# Altium schematic sheet communication.SchDoc: Communication-interface
size B
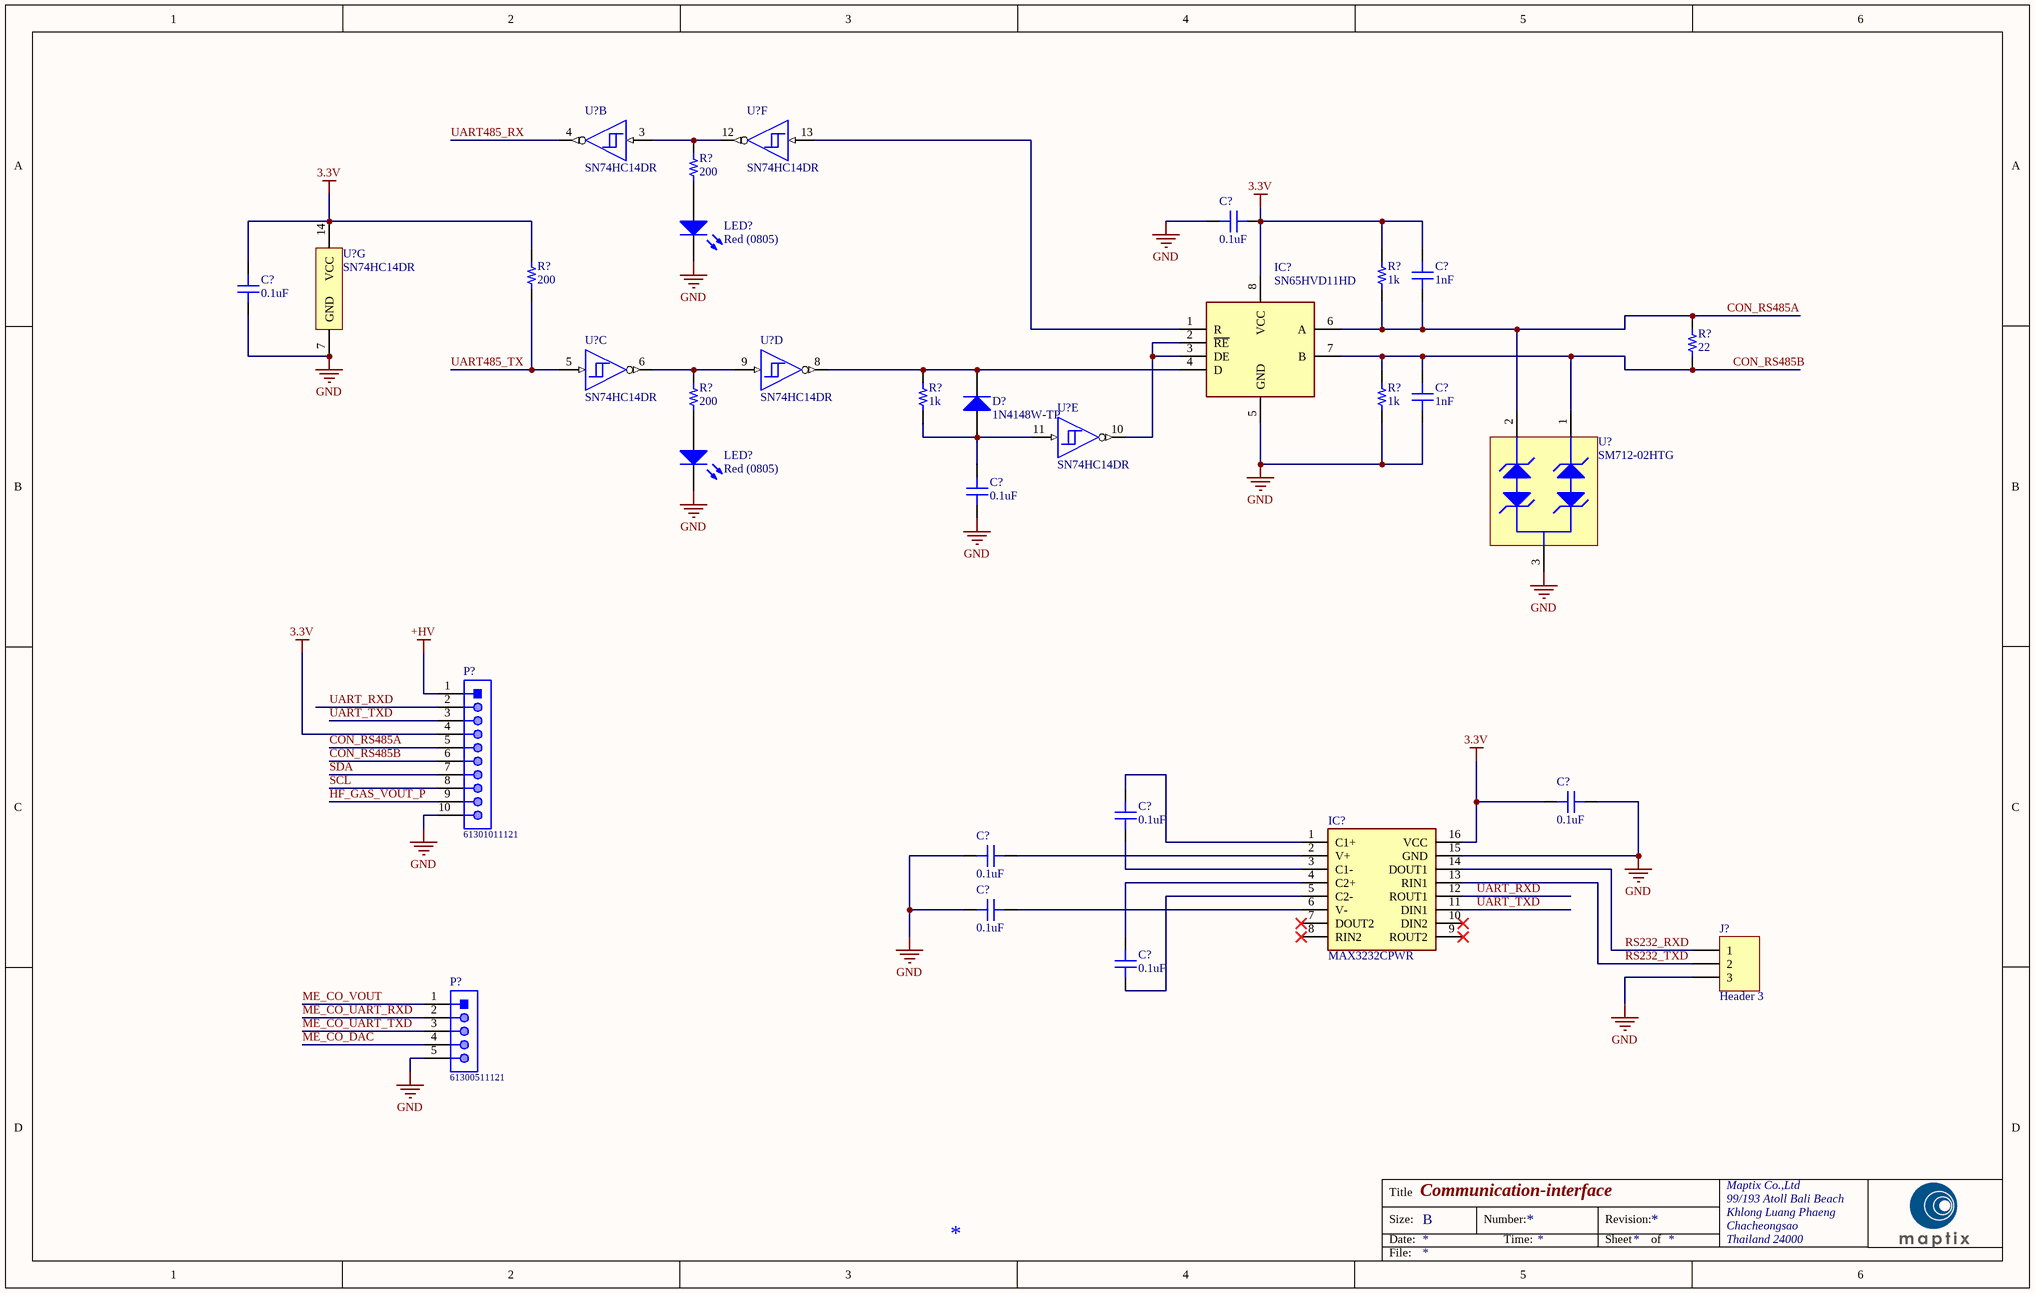
[diagram p0: communication.SchDoc]

## Parts
(Parts that share a designator on the sheet are numbered #1, #2 ... from top to bottom, then left to right.)
C?#1  0.1uF  [CAP 0603_1608]
C?#2  1nF  [CAP 0603_1608]
C?#3  0.1uF  [CAP 0603_1608]
C?#4  1nF  [CAP 0603_1608]
C?#5  0.1uF  [CAP 0603_1608]
C?#6  0.1uF  [CAP 0603_1608]
C?#7  0.1uF  [CAP 0603_1608]
C?#8  0.1uF  [CAP 0603_1608]
C?#9  0.1uF  [CAP 0603_1608]
C?#10  0.1uF  [CAP 0603_1608]
D?  1N4148W-TP  [MCC-SOD123_V]
IC?#1  SN65HVD11HD  [SOIC127P600X175-8N]
IC?#2  MAX3232CPWR  [SOP65P640X120-16N]
J?  Header 3  [HDR1X3]
LED?#1  Red (0805)  [0805_A]
LED?#2  Red (0805)  [0805_A]
P?#1  61301011121  [61301011121]
P?#2  61300511121  [61300511121]
R?#1  200  [RES 0603_1608]
R?#2  200  [RES 0603_1608]
R?#3  1k  [RES 0603_1608]
R?#4  22  [RES 0603_1608]
R?#5  200  [RES 0603_1608]
R?#6  1k  [RES 0603_1608]
R?#7  1k  [RES 0603_1608]
U?#1  SN74HC14DR  [D0014A_N]  (part B of 7)
U?#2  SN74HC14DR  [D0014A_N]  (part F of 7)
U?#3  SN74HC14DR  [D0014A_N]  (part G of 7)
U?#4  SN74HC14DR  [D0014A_N]  (part C of 7)
U?#5  SN74HC14DR  [D0014A_N]  (part D of 7)
U?#6  SN74HC14DR  [D0014A_N]  (part E of 7)
U?#7  SM712-02HTG  [LFUS-SOT23-3_V]

## Nets
3.3V: C?#1.2 C?#2.2 C?#3.2 C?#6.1 IC?#1.8(VCC) IC?#2.16(VCC) P?#1.4 R?#2.2 R?#3.2 U?#3.14(VCC)
+HV: P?#1.1
GND: C?#1.1 C?#3.1 C?#4.1 C?#5.1 C?#6.2 C?#8.1 C?#9.1 IC?#1.5(GND) IC?#2.15(GND) J?.3 LED?#1.1(K) LED?#2.1(K) P?#1.10 P?#2.5 R?#7.1 U?#3.7(GND) U?#7.3
CON_RS485A: C?#2.1 IC?#1.6(A) P?#1.5 R?#3.1 R?#4.2 U?#7.2
CON_RS485B: C?#4.2 IC?#1.7(B) P?#1.6 R?#4.1 R?#7.2 U?#7.1
HF_GAS_VOUT_P: P?#1.9
ME_CO_DAC: P?#2.4
ME_CO_UART_RXD: P?#2.2
ME_CO_UART_TXD: P?#2.3
ME_CO_VOUT: P?#2.1
RS232_RXD: IC?#2.14(DOUT1) J?.1
RS232_TXD: IC?#2.13(RIN1) J?.2
SCL: P?#1.8
SDA: P?#1.7
UART485_RX: U?#1.4(~{2Y})
UART485_TX: R?#2.1 U?#4.5(3A)
UART_RXD: IC?#2.12(ROUT1) P?#1.2
UART_TXD: IC?#2.11(DIN1) P?#1.3
NetC?#5_2: C?#5.2 D?.1(A) R?#6.1 U?#6.11(5A)
NetC?#7_1: C?#7.1 IC?#2.1(C1+)
NetC?#7_2: C?#7.2 IC?#2.3(C1-)
NetC?#8_2: C?#8.2 IC?#2.2(V+)
NetC?#9_2: C?#9.2 IC?#2.6(V-)
NetC?#10_1: C?#10.1 IC?#2.4(C2+)
NetC?#10_2: C?#10.2 IC?#2.5(C2-)
NetD?_2: D?.2(K) IC?#1.4(D) R?#6.2 U?#5.8(~{4Y})
NetIC?#1_1: IC?#1.1(R) U?#2.13(6A)
NetIC?#1_2: IC?#1.2(~{RE}) IC?#1.3(DE) U?#6.10(~{5Y})
NetLED?#1_2: LED?#1.2(A) R?#1.1
NetLED?#2_2: LED?#2.2(A) R?#5.1
NetR?#1_2: R?#1.2 U?#1.3(2A) U?#2.12(~{6Y})
NetR?#5_2: R?#5.2 U?#4.6(~{3Y}) U?#5.9(4A)

Not connected (* = marked no-connect by the designer): IC?#2 7(DOUT2)* 8(RIN2)* 9(ROUT2)* 10(DIN2)*

## Notes on the sheet
- Title
- Size:
- Date:
- B
- Number:
- Time:
- Revision:
- Sheet
- of
- Maptix Co.,Ltd
- 99/193 Atoll Bali Beach
- Khlong Luang Phaeng
- Chacheongsao
- Thailand 24000
- File:

## Library data of the parts
C?#1-C?#10 = VJ0603Y332JXACW1BC: CAP CERAMIC 50V X7R 0603; Manufacturer: Vishay Vitramon; Capacitance: 3300pF; Tolerance: ±5%; Part Number: VJ0603Y332JXACW1BC; Applications: General Purpose; ComponentLink1Description: Datasheet; ComponentLink1URL: https://www.vishay.com/docs/28548/vjw1bcbascomseries.pdf; ComponentLink2Description: DigiKey Link; ComponentLink2URL: http://digikey.com/product-detail/en/vishay-vitramon/VJ0603Y332JXACW1BC/720-VJ0603Y332JXACW1BCCT-ND/11198425; Device Package: 0603 (1608 Metric); LastUpdated: 1/2/2020 12:01:35 AM; Lifecycle Status: Active; Minimum Order: 1; Mounting Type: Surface Mount, MLCC; Operating Temperature: -55°C ~ 125°C; Package / Case: 0603 (1608 Metric); Packaging: Unknown; PartId: 26247; Part Status: Active; Price: 0.00; Series: VJ; Size / Dimension: 0.063" L x 0.031" W (1.60mm x 0.80mm); Supplier 1: DigiKey; Supplier Part Number 1: 720-VJ0603Y332JXACW1BCCT-ND; Temperature Coefficient: X7R; Thickness (Max): 0.034" (0.87mm); Voltage - Rated: 50V
  C?#1 C?#3 C?#5-C?#10: Value: 0.1uF
  C?#2 C?#4: Value: 1nF
D? = CMP-2000-04993-1: High Speed Switching Diode, 400 mW, 150 mA, -65 to 150 degC, 2-Pin SOD123, RoHS, Tape and Reel; Manufacturer: Micro Commercial Components; Reverse Recovery Time-Max: 4ns; Average Forward Current-Max: 0.15A; Peak Current-Max: 2A; Power Dissipation: 400mW; Reverse Voltage-Max [Vrrm]: 100V; Datasheet URL: https://datasheet.ciiva.com/16836/1n4148wsod123-16836277.pdf; Package Reference: SOD123; Package URL: http://www.mccsemi.com/up_pdf/1N4448W(SOD-123).pdf; Package Description: 2-Pin Small Outline Diode, Body 2.7 x 1.6 mm, Height 1.35 mm; Manufacturer URL: http://www.mccsemi.com/; Datasheet Version: Rev. C, 07/2014
IC?#1 = SN65HVD11HD: Integrated Circuit; Manufacturer_Name: Texas Instruments; Datasheet Link: http://www.ti.com/lit/gpn/sn65hvd11-ht; Height: 1.75mm; Manufacturer_Part_Number: SN65HVD11HD; Mouser Part Number: 595-SN65HVD11HD; Mouser Price/Stock: https://www.mouser.com/Search/Refine.aspx?Keyword=595-SN65HVD11HD
IC?#2 = MAX3232CPWR: Integrated Circuit; Manufacturer_Name: Texas Instruments; Datasheet Link: http://www.ti.com/lit/gpn/max3232; Height: 1.2mm; Manufacturer_Part_Number: MAX3232CPWR; Mouser Part Number: 595-MAX3232CPWR; Mouser Price/Stock: https://www.mouser.com/Search/Refine.aspx?Keyword=595-MAX3232CPWR
J? = Header 3: Header, 3-Pin; LatestRevisionDate: 17-Jul-2002; LatestRevisionNote: Re-released for DXP Platform.; Publisher: Altium Limited
LED?#1 LED?#2 = CMP-1426-00007-1: SMD mono-color Chip LED, WL-SMCW, Green; PartNumber: 150080GS75000; Manufacturer: Wuerth Elektronik; PackageReference: 0805_A; Color: Green; ComponentLink2URL: http://katalog.we-online.com/led/datasheet/150080GS75000.pdf; ComponentLink1URL: http://www.we-online.com; ComponentLink1Description: Manufacturer URL; ComponentLink2Description: Datasheet
P?#1 = CMP-1502-01082-1: THT Vertical Pin Header WR-PHD, Pitch 2.54 mm, Single Row, 10 pins; Manufacturer: Wurth Elektronik; Contact Resistance: 20mOhm; Rated Current: 3A; Pitch: 2.54mm; Gender: Male; Pin Number: 10; Working Voltage: 250VAC; Withstanding Voltage: 500VAC; Manufacturer URL: http://www.we-online.de; Operating Temperature: -40to105degC; Datasheet URL: https://katalog.we-online.de/em/datasheet/6130xx11121.pdf; Row Number: Single; Orientation: Vertical; Part Number: 61301011121; Packaging: Bag; Package Reference: 61301011121; Mounting Technology: THT; Publisher: WurthElektronik
P?#2 = CMP-1502-01068-1: THT Vertical Pin Header WR-PHD, Pitch 2.54 mm, Single Row, 5 pins; Manufacturer: Wurth Elektronik; Pin Number: 5; Contact Resistance: 20mOhm; Working Voltage: 250VAC; Pitch: 2.54mm; Withstanding Voltage: 500VAC; Rated Current: 3A; Gender: Male; Datasheet URL: https://katalog.we-online.de/em/datasheet/6130xx11121.pdf; Orientation: Vertical; Mounting Technology: THT; Row Number: Single; Package Reference: 61300511121; Publisher: WurthElektronik; Part Number: 61300511121; Packaging: Bag; Manufacturer URL: http://www.we-online.de; Operating Temperature: -40to105degC
R?#1-R?#7 = CRCW060329K4FKEA: Resistor; Manufacturer: Vishay Dale; Power (Watts): 0.1W, 1/10W; Resistance: 29.4 kOhms; Temperature Coefficient: ±100ppm/°C; Tolerance: ±1%; Part Number: CRCW060329K4FKEA; ComponentLink1Description: Datasheet; ComponentLink1URL: http://www.vishay.com/docs/20035/dcrcwe3.pdf; ComponentLink2Description: DigiKey Link; ComponentLink2URL: http://digikey.com/product-detail/en/vishay-dale/CRCW060329K4FKEA/541-29.4KHCT-ND/1179975; Composition: Thick Film; Device Package: 0603 (1608 Metric); Features: Automotive AEC-Q200; Height - Seated (Max): 0.020" (0.50mm); LastUpdated: 1/2/2020 12:06:58 AM; Lifecycle Status: Active; Minimum Order: 1; Number of Terminations: 2; Operating Temperature: -55°C ~ 155°C; Package / Case: 0603 (1608 Metric); Packaging: TapeAndReel; PartId: 7975; Part Status: Active; Price: 0.00; Ratings: AEC-Q200; Series: CRCW; Size / Dimension: 0.061" L x 0.033" W (1.55mm x 0.85mm); Supplier 1: DigiKey; Supplier Part Number 1: 541-29.4KHCT-ND; Supplier Device Package: 0603
  R?#1 R?#2 R?#5: Value: 200
  R?#3 R?#6 R?#7: Value: 1k
  R?#4: Value: 22
U?#1-U?#6 = CMP-1615-00273-3: Hex Schmitt-Trigger Inverters, D0014A, LARGE T&R; Manufacturer: Texas Instruments; tpd @ Nom Voltage(Max)(ns): 31; Schmitt Trigger: Yes; Output Drive (IOL/IOH)(Max)(mA): -4/4; F @ Nom Voltage(Max)(Mhz): 20; Technology Family: HC; Output Type: CMOS; VCC(Min)(V): 2; ICC @ Nom Voltage(Max)(mA): 0.02; Bits(#): 6; Rating: Catalog; Voltage(Nom)(V): 5; PackageReference: D0014A; Code_JEDEC: MS-012; Input Type: CMOS; Operating Temperature Range(C): -40 to 85; Generic Part Number: SN74HC14; VCC(Max)(V): 6; DatasheetVersion: SCLS085G
U?#7 = CMP-2000-07561-1: TVS Diode Array, 600 W, 12 V, -40 to 125 degC, 3-Pin SOT23, RoHS, Tape and Reel; Manufacturer: Littelfuse; Case\/Package: TO-236-3; Number of Bidirectional Channels: 2; Min Breakdown Voltage: 13.3V; Clamping Voltage: 31V; Direction: Bidirectional; Element Configuration: Dual; Reverse Standoff Voltage: 12V; Max Surge Current: 19A; Leakage Current: 20uA; Capacitance: 75pF; Max Power Dissipation: 600W; Power Line Protection: No; Depth: 1.4mm; Packaging: TapeandReel; Datasheet URL: http://www.littelfuse.com/~/media/electronics/datasheets/tvs_diode_arrays/littelfuse_tvs_diode_array_sm712_datasheet.pdf.pdf; Package Description: 3-Pin Surface Mount Device, Body 2.92 x 1.3 mm, Pitch 0.95 mm; Package Reference: SOT23-3; Lead Free: LeadFree; Datasheet Version: 12/2016; Termination: SMD/SMT; Mounting Technology: SurfaceMount; Package Quantity: 3000; Radiation Hardening: No; Min Operating Temperature: -40degC; Breakdown Voltage: 13.3V; Working Voltage: 12V; RoHSCompliant: True; Number of Channels: 2; Number of Pins: 3; Max Operating Temperature: 125degC; Manufacturer URL: http://www.littelfuse.com/; Polarity: Bidirectional; Mount: SurfaceMount; Peak Pulse Current: 19A; Peak Pulse Power: 600W; Length: 3.04mm